# Altium schematic sheet [1] Schematic Blocks.SchDoc
size A3; DocumentNumber: 1; SheetNumber: 1; SheetTotal: 11
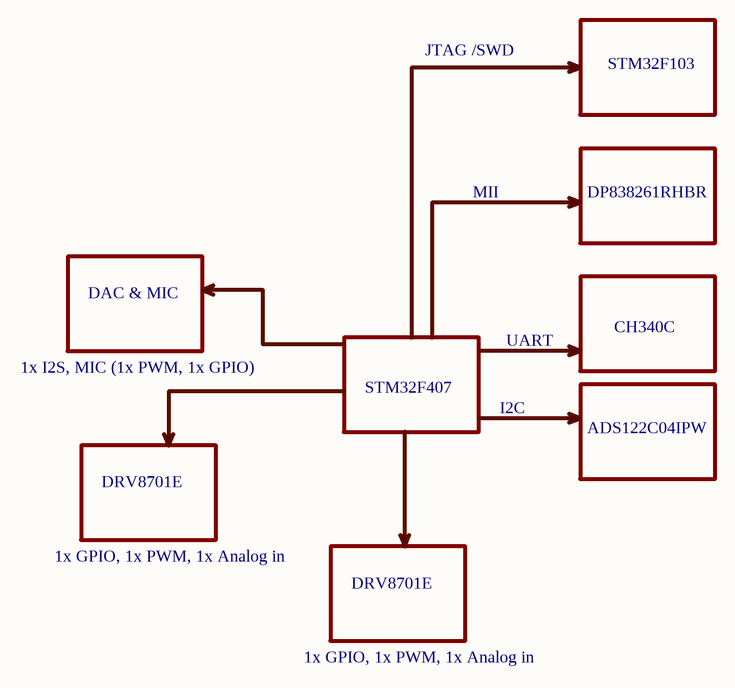
[diagram p0: [1] Schematic Blocks.SchDoc]

## Notes on the sheet
- JTAG /SWD
- STM32F103
- MII
- DP838261RHBR
- DAC & MIC
- 1x I2S, MIC (1x PWM, 1x GPIO)
- STM32F407
- UART
- CH340C
- I2C
- ADS122C04IPW
- DRV8701E
- 1x GPIO, 1x PWM, 1x Analog in